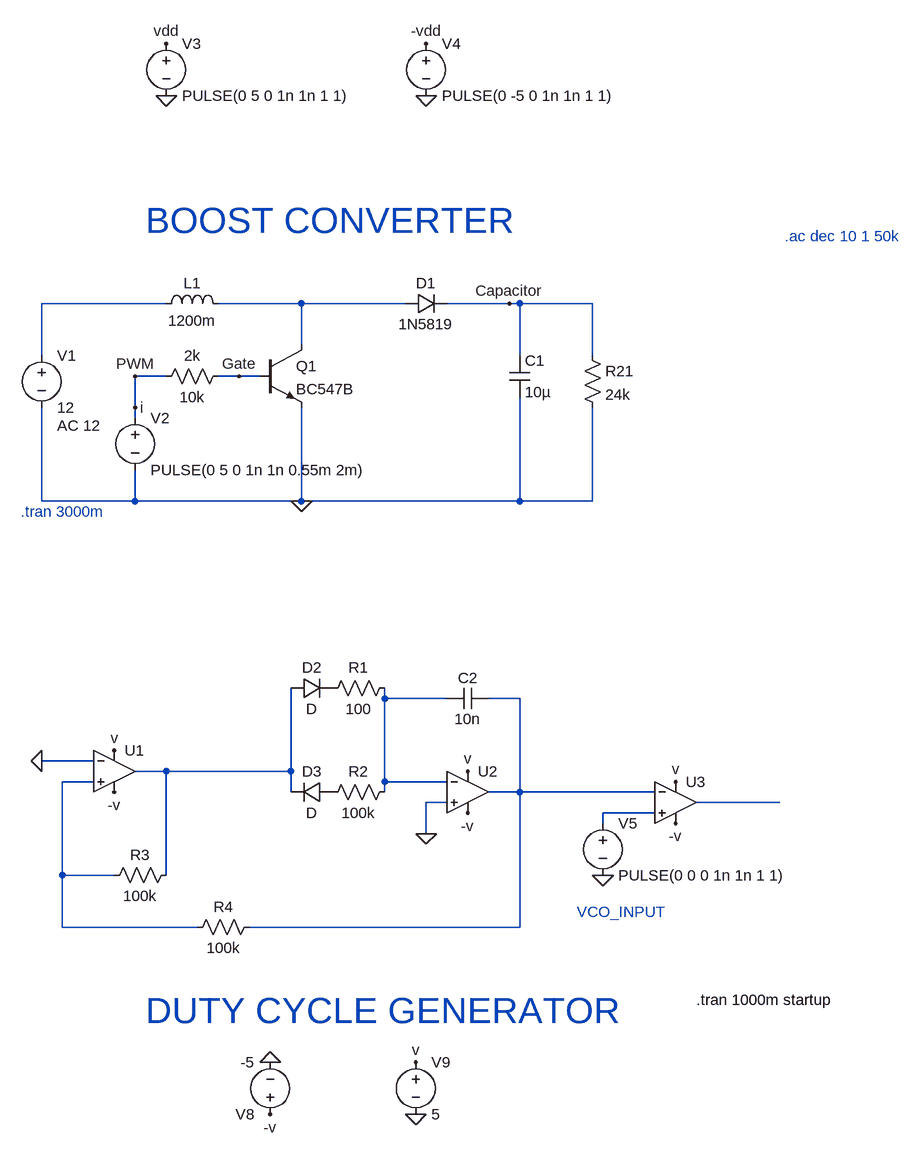
[diagram p0: schematic BOOST+SAWTOOTH.asc]
BOOST+SAWTOOTH.asc, the LTspice schematic file:
Version 4.1
SHEET 1 1652 6172
WIRE -16 16 -208 16
WIRE 192 16 64 16
WIRE 352 16 192 16
WIRE 512 16 416 16
WIRE 528 16 512 16
WIRE 640 16 528 16
WIRE 192 80 192 16
WIRE -208 96 -208 16
WIRE 528 96 528 16
WIRE 640 96 640 16
WIRE -16 128 -64 128
WIRE 96 128 64 128
WIRE 128 128 96 128
WIRE -64 176 -64 128
WIRE -64 192 -64 176
WIRE -208 320 -208 176
WIRE -64 320 -64 272
WIRE -64 320 -208 320
WIRE 192 320 192 176
WIRE 192 320 -64 320
WIRE 528 320 528 160
WIRE 528 320 192 320
WIRE 640 320 640 176
WIRE 640 320 528 320
WIRE 320 624 320 608
WIRE 416 624 320 624
WIRE 528 624 480 624
WIRE -128 720 -208 720
WIRE -16 736 -64 736
WIRE 176 736 176 608
WIRE 176 736 -16 736
WIRE -128 752 -176 752
WIRE 320 752 320 624
WIRE 416 752 320 752
WIRE 176 768 176 736
WIRE 320 768 320 752
WIRE 528 768 528 624
WIRE 528 768 480 768
WIRE 736 768 528 768
WIRE 416 784 384 784
WIRE 928 784 800 784
WIRE 736 800 656 800
WIRE 656 816 656 800
WIRE 384 832 384 784
WIRE -176 896 -176 752
WIRE -96 896 -176 896
WIRE -16 896 -16 736
WIRE -176 976 -176 896
WIRE 32 976 -176 976
WIRE 528 976 528 768
WIRE 528 976 112 976
FLAG 192 320 0
FLAG -64 128 PWM
FLAG 96 128 Gate
FLAG 512 16 Capacitor
FLAG -208 720 0
FLAG -16 -304 0
FLAG -16 -384 vdd
FLAG 384 -304 0
FLAG 384 -384 -vdd
FLAG -96 704 v
FLAG -96 768 -v
FLAG 448 736 v
FLAG 448 800 -v
FLAG 384 832 0
FLAG 768 752 v
FLAG 768 816 -v
FLAG 656 896 0
FLAG -64 176 i
FLAG 144 1184 0
FLAG 368 1264 0
FLAG 144 1264 -v
FLAG 368 1184 v
SYMBOL ind -32 32 R270
WINDOW 0 32 56 VTop 2
WINDOW 3 5 56 VBottom 2
SYMATTR InstName L1
SYMATTR Value 1200m
SYMBOL voltage -208 80 R0
WINDOW 123 24 124 Left 2
WINDOW 39 0 0 Left 0
SYMATTR Value2 AC 12
SYMATTR InstName V1
SYMATTR Value 12
SYMBOL voltage -64 176 R0
WINDOW 123 0 0 Left 0
WINDOW 39 0 0 Left 0
SYMATTR InstName V2
SYMATTR Value PULSE(0 5 0 1n 1n 0.55m 2m)
SYMBOL cap 512 96 R0
SYMATTR InstName C1
SYMATTR Value 10µ
SYMBOL diode 352 32 R270
WINDOW 0 32 32 VTop 2
WINDOW 3 0 32 VBottom 2
SYMATTR InstName D1
SYMATTR Value 1N5819
SYMBOL res 624 80 R0
SYMATTR InstName R21
SYMATTR Value 24k
SYMBOL npn 128 80 R0
SYMATTR InstName Q1
SYMATTR Value BC547B
SYMBOL res 80 112 R90
WINDOW 0 0 56 VBottom 2
WINDOW 3 32 56 VTop 2
SYMATTR InstName 2k
SYMATTR Value 10k
SYMBOL OpAmps\\UniversalOpAmp2 -96 736 R0
SYMATTR InstName U1
SYMBOL voltage -16 -400 R0
WINDOW 123 0 0 Left 0
WINDOW 39 0 0 Left 0
SYMATTR InstName V3
SYMATTR Value PULSE(0 5 0 1n 1n 1 1)
SYMBOL voltage 384 -400 R0
WINDOW 123 0 0 Left 0
WINDOW 39 0 0 Left 0
SYMATTR InstName V4
SYMATTR Value PULSE(0 -5 0 1n 1n 1 1)
SYMBOL res 0 880 R90
WINDOW 0 0 56 VBottom 2
WINDOW 3 32 56 VTop 2
SYMATTR InstName R3
SYMATTR Value 100k
SYMBOL res 336 752 R90
WINDOW 0 0 56 VBottom 2
WINDOW 3 32 56 VTop 2
SYMATTR InstName R2
SYMATTR Value 100k
SYMBOL res 336 592 R90
WINDOW 0 0 56 VBottom 2
WINDOW 3 32 56 VTop 2
SYMATTR InstName R1
SYMATTR Value 100
SYMBOL diode 176 624 R270
WINDOW 0 32 32 VTop 2
WINDOW 3 0 32 VBottom 2
SYMATTR InstName D2
SYMBOL diode 240 752 R90
WINDOW 0 0 32 VBottom 2
WINDOW 3 32 32 VTop 2
SYMATTR InstName D3
SYMBOL res 128 960 R90
WINDOW 0 0 56 VBottom 2
WINDOW 3 32 56 VTop 2
SYMATTR InstName R4
SYMATTR Value 100k
SYMBOL OpAmps\\UniversalOpAmp2 448 768 R0
SYMATTR InstName U2
SYMBOL cap 480 608 R90
WINDOW 0 0 32 VBottom 2
WINDOW 3 32 32 VTop 2
SYMATTR InstName C2
SYMATTR Value 10n
SYMBOL OpAmps\\UniversalOpAmp2 768 784 R0
SYMATTR InstName U3
SYMBOL voltage 656 800 R0
WINDOW 123 0 0 Left 0
WINDOW 39 0 0 Left 0
SYMATTR InstName V5
SYMATTR Value PULSE(0 0 0 1n 1n 1 1)
SYMBOL voltage 144 1280 R180
WINDOW 123 0 0 Left 0
WINDOW 39 0 0 Left 0
SYMATTR InstName V8
SYMATTR Value -5
SYMBOL voltage 368 1168 R0
WINDOW 123 0 0 Left 0
WINDOW 39 0 0 Left 0
SYMATTR InstName V9
SYMATTR Value 5
TEXT -240 336 Left 2 ;.tran 3000m
TEXT 936 -88 Left 2 ;.ac dec 10 1 50k
TEXT 616 952 Left 2 ;VCO_INPUT
TEXT -48 1104 Left 5 ;DUTY CYCLE GENERATOR
TEXT -48 -112 Left 5 ;BOOST CONVERTER
TEXT 800 1088 Left 2 !.tran 1000m startup

The netlist it stands for:
* BOOST+SAWTOOTH.asc
L1 N001 N002 1200m
V1 N001 0 12 AC 12
V2 i 0 PULSE(0 5 0 1n 1n 0.55m 2m)
C1 Capacitor 0 10µ
D1 N002 Capacitor 1N5819
R21 Capacitor 0 24k
Q1 N002 Gate 0 0 BC547B
R§2k Gate i 10k
X§U1 N006 0 v -v N005 level2 Avol=1Meg GBW=10Meg Slew=10Meg Ilimit=25m Rail=0 Vos=0 En=0 Enk=0 In=0 Ink=0 Rin=500Meg  ; pins In+ In- V+ V- OUT
V3 vdd 0 PULSE(0 5 0 1n 1n 1 1)
V4 -vdd 0 PULSE(0 -5 0 1n 1n 1 1)
R3 N005 N006 100k
R2 N003 P001 100k
R1 N003 P002 100
D2 N005 P002 D
D3 P001 N005 D
R4 N004 N006 100k
X§U2 0 N003 v -v N004 level2 Avol=1Meg GBW=10Meg Slew=10Meg Ilimit=25m Rail=0 Vos=0 En=0 Enk=0 In=0 Ink=0 Rin=500Meg  ; pins In+ In- V+ V- OUT
C2 N004 N003 10n
X§U3 N008 N004 v -v N007 level2 Avol=1Meg GBW=10Meg Slew=10Meg Ilimit=25m Rail=0 Vos=0 En=0 Enk=0 In=0 Ink=0 Rin=500Meg  ; pins In+ In- V+ V- OUT
V5 N008 0 PULSE(0 0 0 1n 1n 1 1)
V8 -v 0 -5
V9 v 0 5
.model D D
.lib standard.dio
.model NPN NPN
.model PNP PNP
.lib standard.bjt
* .tran 3000m
* .ac dec 10 1 50k
* VCO_INPUT
* DUTY CYCLE GENERATOR
* BOOST CONVERTER
.tran 1000m startup
.lib UniversalOpAmp2.lib
.backanno
.end